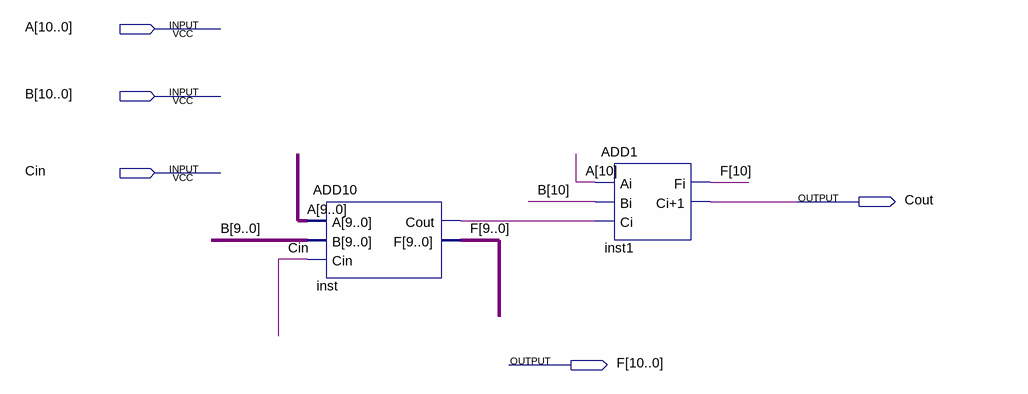
[diagram p0: schematic sheet]
// Quartus schematic ADD11.bdf as structural Verilog: 2 symbols, 5 pins
module ADD11 (
  input  [10:0] A,
  input  [10:0] B,
  input  Cin,
  output Cout,
  output [10:0] F
);

  wire inst_cout;

  ADD10 inst (.A(A[9:0]), .B(B[9:0]), .Cin(Cin), .Cout(inst_cout), .F(F[9:0]));
  ADD1 inst1 (.Ai(A[10]), .Bi(B[10]), .Ci(inst_cout), .Fi(F[10]), .\Ci+1 (Cout));
endmodule
